# Altium schematic sheet PHY_Top_Demo.SchDoc
size A4
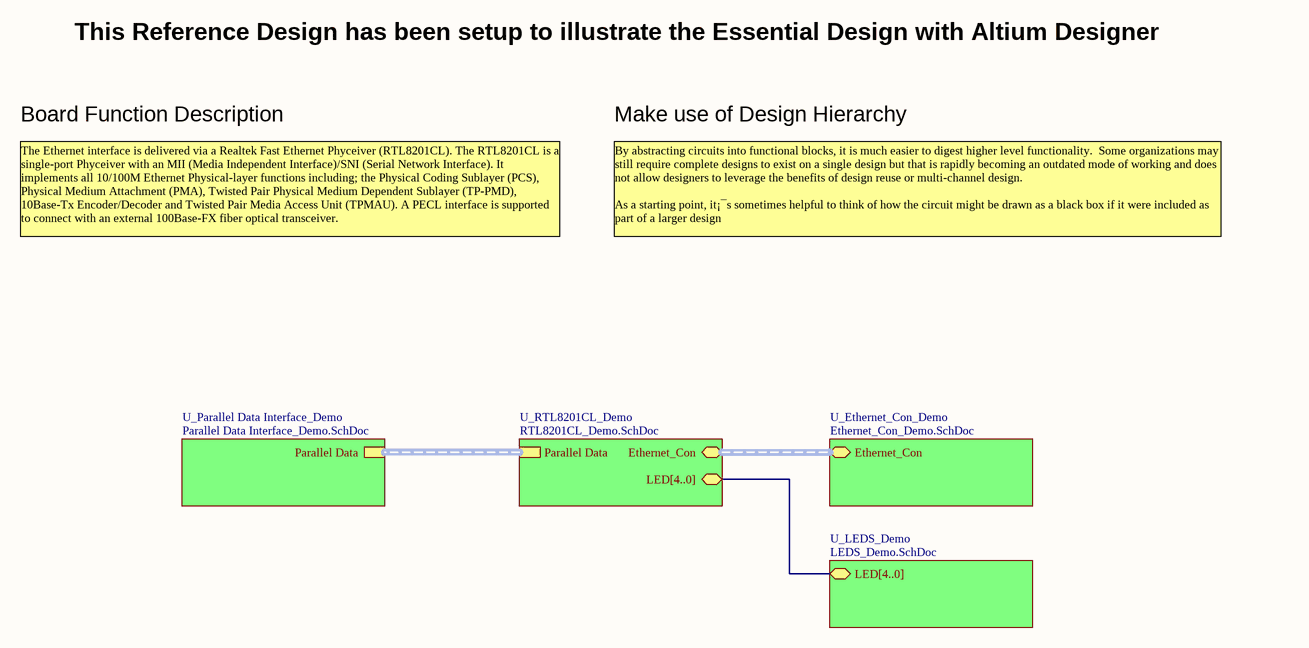
[diagram p0: PHY_Top_Demo.SchDoc]

## Sub-sheets
U_Ethernet_Con_Demo = Ethernet_Con_Demo.SchDoc: Ethernet_Con (harness Con)
U_LEDS_Demo = LEDS_Demo.SchDoc: LED[4..0] (bidir)
U_Parallel Data Interface_Demo = Parallel Data Interface_Demo.SchDoc: Parallel Data (harness Parallel Data Sets)
U_RTL8201CL_Demo = RTL8201CL_Demo.SchDoc: Parallel Data (harness Parallel Data Sets), LED[4..0] (bidir), Ethernet_Con (harness Con)

## Buses and harness runs
bus sheet U_LEDS_Demo/LED[4..0] = sheet U_RTL8201CL_Demo/LED[4..0]
harness sheet U_Ethernet_Con_Demo/Ethernet_Con = sheet U_RTL8201CL_Demo/Ethernet_Con
harness sheet U_Parallel Data Interface_Demo/Parallel Data = sheet U_RTL8201CL_Demo/Parallel Data

## Notes on the sheet
- This Reference Design has been setup to illustrate the Essential Design with Altium Designer
- Board Function Description
- Make use of Design Hierarchy
- The Ethernet interface is delivered via a Realtek Fast Ethernet Phyceiver (RTL8201CL). The RTL8201CL is a single-port Phyceiver with an MII (Media Independent Interface)/SNI (Serial Network Interface). It implements all 10/100M Ethernet Physical-layer functions including; the Physical Coding Sublayer (PCS), Physical Medium Attachment (PMA), Twisted Pair Physical Medium Dependent Sublayer (TP-PMD), 10Base-Tx Encoder/Decoder and Twisted Pair Media Access Unit (TPMAU). A PECL interface is supported to connect with an external 100Base-FX fiber optical transceiver.
- By abstracting circuits into functional blocks, it is much easier to digest higher level functionality.  Some organizations may still require complete designs to exist on a single design but that is rapidly becoming an outdated mode of working and does not allow designers to leverage the benefits of design reuse or multi-channel design.
  As a starting point, it¡¯s sometimes helpful to think of how the circuit might be drawn as a black box if it were included as part of a larger design
- Title
- Size:
- Date:
- A4
- Number:
- Time:
- Revision:
- Sheet
- of
- File: